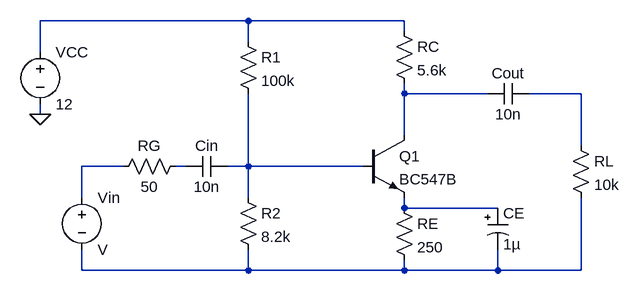
[diagram p0: schematic simulación.asc]
simulación.asc, the LTspice schematic file:
Version 4
SHEET 1 900 680
WIRE 320 96 0 96
WIRE 560 96 320 96
WIRE 560 112 560 96
WIRE 320 128 320 96
WIRE 0 144 0 96
WIRE 560 208 560 192
WIRE 688 208 560 208
WIRE 832 208 752 208
WIRE 0 240 0 224
WIRE 560 272 560 208
WIRE 832 288 832 208
WIRE 128 320 64 320
WIRE 224 320 208 320
WIRE 320 320 320 208
WIRE 320 320 288 320
WIRE 496 320 320 320
WIRE 64 368 64 320
WIRE 320 368 320 320
WIRE 560 384 560 368
WIRE 704 384 560 384
WIRE 64 480 64 448
WIRE 320 480 320 448
WIRE 320 480 64 480
WIRE 560 480 560 464
WIRE 560 480 320 480
WIRE 704 480 704 448
WIRE 704 480 560 480
WIRE 832 480 832 368
WIRE 832 480 704 480
FLAG 0 240 0
SYMBOL voltage 0 128 R0
SYMATTR InstName VCC
SYMATTR Value 12
SYMBOL res 304 112 R0
SYMATTR InstName R1
SYMATTR Value 100k
SYMBOL res 544 96 R0
SYMATTR InstName RC
SYMATTR Value 5.6k
SYMBOL cap 752 192 R90
WINDOW 0 0 32 VBottom 2
WINDOW 3 32 32 VTop 2
SYMATTR InstName Cout
SYMATTR Value 10n
SYMBOL res 816 272 R0
SYMATTR InstName RL
SYMATTR Value 10k
SYMBOL voltage 64 352 R0
SYMATTR InstName Vin
SYMBOL res 224 304 R90
WINDOW 0 0 56 VBottom 2
WINDOW 3 32 56 VTop 2
SYMATTR InstName RG
SYMATTR Value 50
SYMBOL cap 288 304 R90
WINDOW 0 0 32 VBottom 2
WINDOW 3 32 32 VTop 2
SYMATTR InstName Cin
SYMATTR Value 10n
SYMBOL res 304 352 R0
SYMATTR InstName R2
SYMATTR Value 8.2k
SYMBOL res 544 368 R0
SYMATTR InstName RE
SYMATTR Value 250
SYMBOL npn 496 272 R0
SYMATTR InstName Q1
SYMATTR Value BC547B
SYMBOL polcap 688 384 R0
SYMATTR InstName CE
SYMATTR Value 1µ

The netlist it stands for:
* simulación.asc
VCC N001 0 12
R1 N001 N006 100k
RC N001 N002 5.6k
Cout N003 N002 10n
RL N003 N008 10k
Vin N004 N008 V
RG N005 N004 50
Cin N006 N005 10n
R2 N006 N008 8.2k
RE N007 N008 250
Q1 N002 N006 N007 0 BC547B
CE N007 N008 1µ
.model NPN NPN
.model PNP PNP
.lib standard.bjt
.backanno
.end